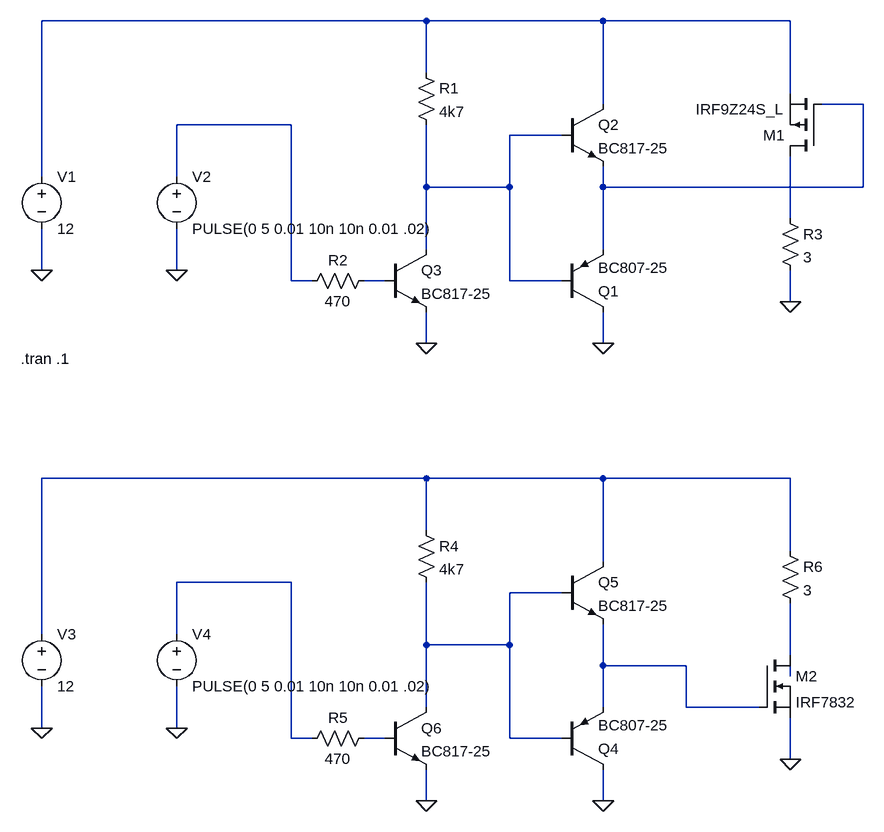
[diagram p0: schematic FET driver.asc]
FET driver.asc, the LTspice schematic file:
Version 4
SHEET 1 880 1092
WIRE 80 -464 -512 -464
WIRE 352 -464 80 -464
WIRE 640 -464 352 -464
WIRE 80 -384 80 -464
WIRE 640 -352 640 -464
WIRE 352 -336 352 -464
WIRE 752 -336 688 -336
WIRE -128 -304 -304 -304
WIRE 288 -288 208 -288
WIRE -512 -224 -512 -464
WIRE -304 -224 -304 -304
WIRE 80 -208 80 -304
WIRE 208 -208 208 -288
WIRE 208 -208 80 -208
WIRE 352 -208 352 -240
WIRE 752 -208 752 -336
WIRE 752 -208 352 -208
WIRE 640 -160 640 -256
WIRE 80 -112 80 -208
WIRE 352 -112 352 -208
WIRE -512 -80 -512 -144
WIRE -304 -80 -304 -144
WIRE -128 -64 -128 -304
WIRE -96 -64 -128 -64
WIRE 16 -64 -16 -64
WIRE 208 -64 208 -208
WIRE 288 -64 208 -64
WIRE 640 -32 640 -80
WIRE 80 32 80 -16
WIRE 352 32 352 -16
WIRE 80 240 -512 240
WIRE 352 240 80 240
WIRE 640 240 352 240
WIRE 80 320 80 240
WIRE 640 352 640 240
WIRE 352 368 352 240
WIRE -128 400 -304 400
WIRE 288 416 208 416
WIRE -512 480 -512 240
WIRE -304 480 -304 400
WIRE 80 496 80 400
WIRE 208 496 208 416
WIRE 208 496 80 496
WIRE 640 512 640 432
WIRE 352 528 352 464
WIRE 480 528 352 528
WIRE 640 544 640 528
WIRE 80 592 80 496
WIRE 352 592 352 528
WIRE 480 592 480 528
WIRE 592 592 480 592
WIRE -512 624 -512 560
WIRE -304 624 -304 560
WIRE -128 640 -128 400
WIRE -96 640 -128 640
WIRE 16 640 -16 640
WIRE 208 640 208 496
WIRE 288 640 208 640
WIRE 640 672 640 608
WIRE 80 736 80 688
WIRE 352 736 352 688
FLAG 80 32 0
FLAG 352 32 0
FLAG -512 -80 0
FLAG -304 -80 0
FLAG 640 -32 0
FLAG 80 736 0
FLAG 352 736 0
FLAG -512 624 0
FLAG -304 624 0
FLAG 640 672 0
SYMBOL pnp 288 -16 M180
SYMATTR InstName Q1
SYMATTR Value BC807-25
SYMBOL npn 288 -336 R0
SYMATTR InstName Q2
SYMATTR Value BC817-25
SYMBOL npn 16 -112 R0
SYMATTR InstName Q3
SYMATTR Value BC817-25
SYMBOL res 64 -400 R0
SYMATTR InstName R1
SYMATTR Value 4k7
SYMBOL voltage -512 -240 R0
WINDOW 123 0 0 Left 0
WINDOW 39 0 0 Left 0
SYMATTR InstName V1
SYMATTR Value 12
SYMBOL voltage -304 -240 R0
WINDOW 123 0 0 Left 0
WINDOW 39 0 0 Left 0
SYMATTR InstName V2
SYMATTR Value PULSE(0 5 0.01 10n 10n 0.01 .02)
SYMBOL res 0 -80 R90
WINDOW 0 0 56 VBottom 0
WINDOW 3 32 56 VTop 0
SYMATTR InstName R2
SYMATTR Value 470
SYMBOL res 624 -176 R0
SYMATTR InstName R3
SYMATTR Value 3
SYMBOL pmos 688 -256 R180
SYMATTR InstName M1
SYMATTR Value IRF9Z24S_L
SYMBOL pnp 288 688 M180
SYMATTR InstName Q4
SYMATTR Value BC807-25
SYMBOL npn 288 368 R0
SYMATTR InstName Q5
SYMATTR Value BC817-25
SYMBOL npn 16 592 R0
SYMATTR InstName Q6
SYMATTR Value BC817-25
SYMBOL res 64 304 R0
SYMATTR InstName R4
SYMATTR Value 4k7
SYMBOL voltage -512 464 R0
WINDOW 123 0 0 Left 0
WINDOW 39 0 0 Left 0
SYMATTR InstName V3
SYMATTR Value 12
SYMBOL voltage -304 464 R0
WINDOW 123 0 0 Left 0
WINDOW 39 0 0 Left 0
SYMATTR InstName V4
SYMATTR Value PULSE(0 5 0.01 10n 10n 0.01 .02)
SYMBOL res 0 624 R90
WINDOW 0 0 56 VBottom 0
WINDOW 3 32 56 VTop 0
SYMATTR InstName R5
SYMATTR Value 470
SYMBOL res 624 336 R0
SYMATTR InstName R6
SYMATTR Value 3
SYMBOL nmos 592 512 R0
SYMATTR InstName M2
SYMATTR Value IRF7832
TEXT -544 56 Left 0 !.tran .1

The netlist it stands for:
* FET driver.asc
Q1 0 N004 N002 0 BC807-25
Q2 N001 N004 N002 0 BC817-25
Q3 N004 N006 0 0 BC817-25
R1 N001 N004 4k7
V1 N001 0 12
V2 N003 0 PULSE(0 5 0.01 10n 10n 0.01 .02)
R2 N006 N003 470
R3 N005 0 3
M1 N005 N002 N001 N001 IRF9Z24S_L
Q4 0 N009 N011 0 BC807-25
Q5 N007 N009 N011 0 BC817-25
Q6 N009 N013 0 0 BC817-25
R4 N007 N009 4k7
V3 N007 0 12
V4 N008 0 PULSE(0 5 0.01 10n 10n 0.01 .02)
R5 N013 N008 470
R6 N007 N010 3
M2 N010 N011 0 0 IRF7832
.model NPN NPN
.model PNP PNP
.lib standard.bjt
.model NMOS NMOS
.model PMOS PMOS
.lib standard.mos
.tran .1
.backanno
.end